# Altium schematic sheet SSRs.SchDoc
size A
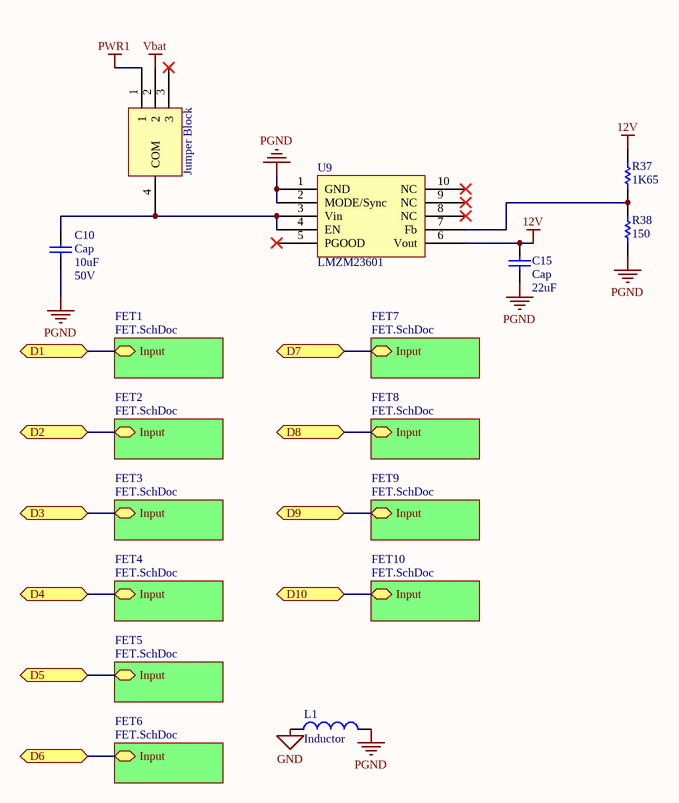
[diagram p0: SSRs.SchDoc]

## Parts
C10  Cap  value 10uF  Voltage Rating: 50V  [CAPC3216X180N]
C15  Cap  value 22uF  [CAPC3216X180N]
J6  Jumper Block  [Jumper Block]
L1  Inductor  [0402-A]
R37  value 1K65  [0402]  (hidden comment: Res1)
R38  value 150  [0402]  (hidden comment: Res1)
U9  LMZM23601  [MODULE_LMZM23600V3SILT]

## Sub-sheets
FET1 = FET.SchDoc: Input
FET2 = FET.SchDoc: Input
FET3 = FET.SchDoc: Input
FET4 = FET.SchDoc: Input
FET5 = FET.SchDoc: Input
FET6 = FET.SchDoc: Input
FET7 = FET.SchDoc: Input
FET8 = FET.SchDoc: Input
FET9 = FET.SchDoc: Input
FET10 = FET.SchDoc: Input

## Ports
D1, D2, D3, D4, D5, D6, D7, D8, D9, D10

## Nets
12V: C15.2 R37.2 U9.6(Vout)
GND: L1.1
PGND: C10.1 C15.1 L1.2 R38.1 U9.1(GND) U9.2(MODE/Sync)
PWR1: J6.1
Vbat: J6.2
D1: port D1, sheet FET1/Input
D2: port D2, sheet FET2/Input
D3: port D3, sheet FET3/Input
D4: port D4, sheet FET4/Input
D5: port D5, sheet FET5/Input
D6: port D6, sheet FET6/Input
D7: port D7, sheet FET7/Input
D8: port D8, sheet FET8/Input
D9: port D9, sheet FET9/Input
D10: port D10, sheet FET10/Input
NetC10_2: C10.2 J6.4(COM) U9.3(Vin) U9.4(EN)
NetR37_1: R37.1 R38.2 U9.7(Fb)

Not connected (* = marked no-connect by the designer): J6 3*; U9 5(PGOOD)* 8(NC)* 9(NC)* 10(NC)*

## Library data of the parts
C10 = Cap: Capacitor; Manufacturer Part Number: CL31A106MBHNNNE; Vendor Part Number: 1276-6736-1-ND
C15 = Cap: Capacitor; Manufacturer Part Number: CL31A226KAHNNNE; Vendor Part Number: 1276-3047-1-ND
L1 = Inductor: Manufacturer Part Number: MPZ1005S300CT000; Vendor Part Number: 445-2979-1-ND
R37 = Res1: Resistor; Manufacturer Part Number: YAG3043CT-ND; Vendor Part Number: RC0402FR-071K65L; Tolerance: 1%
R38 = Res1: Resistor; Manufacturer Part Number: RC0402FR-07150RL; Vendor Part Number: 311-150LRCT-ND; Tolerance: 1%
U9 = LMZM23601: Manufacturer Part Number: LMZM23601SILT; Vendor Part Number: 296-49460-1-ND